# Altium project 大三_实训作业_智能家居控制.PrjPcb
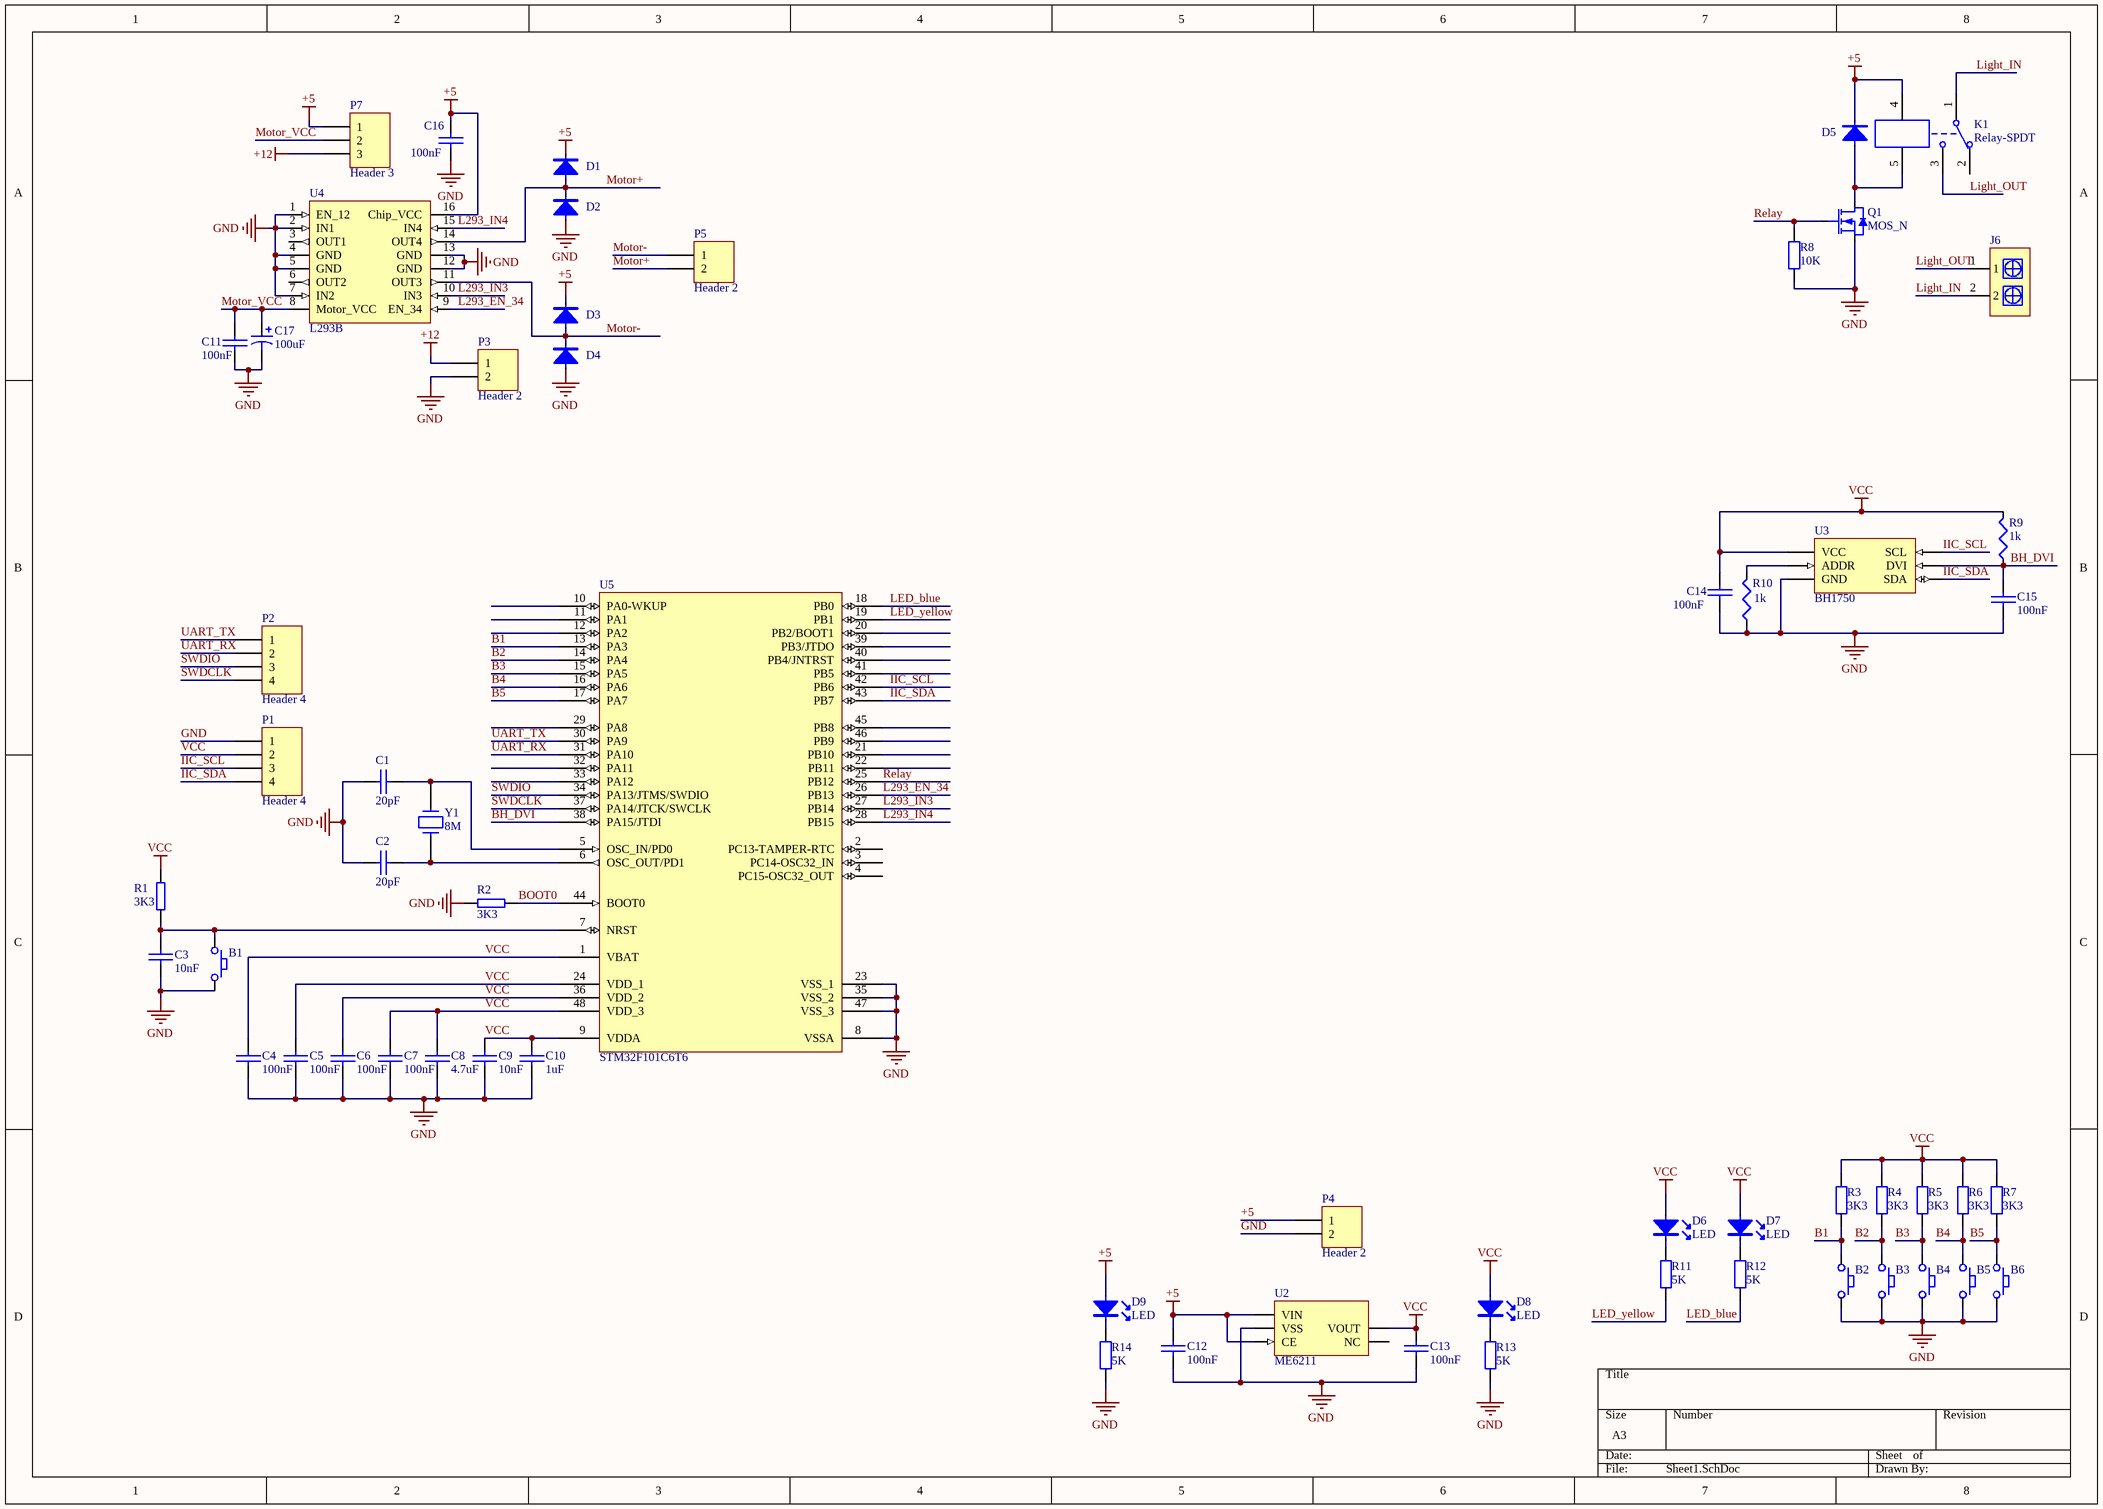
[diagram p0: Sheet1.SchDoc]
1 sheet, 60 parts. Net scope: global (net labels, ports and power ports of the same name join across sheets).
Board file: PCB1.PcbDoc

## Sheet Sheet1.SchDoc
size A3

### Parts
B1  button  [switch_2P]  (value not drawn)
B2  button  [switch_2P]  (value not drawn)
B3  button  [switch_2P]  (value not drawn)
B4  button  [switch_2P]  (value not drawn)
B5  button  [switch_2P]  (value not drawn)
B6  button  [switch_2P]  (value not drawn)
C1  20pF  [0603]
C2  20pF  [0603]
C3  10nF  [0603]
C4  100nF  [0603]
C5  100nF  [0603]
C6  100nF  [0603]
C7  100nF  [0603]
C8  4.7uF  [0603]
C9  10nF  [0603]
C10  1uF  [0603]
C11  100nF  [0603]
C12  100nF  [0603]
C13  100nF  [0603]
C14  100nF  [0603]
C15  100nF  [0603]
C16  100nF  [0603]
C17  100uF  [CAP_3.5_8mm]
D1  Diode_short  [SOD_123]  (value not drawn)
D2  Diode_short  [SOD_123]  (value not drawn)
D3  Diode_short  [SOD_123]  (value not drawn)
D4  Diode_short  [SOD_123]  (value not drawn)
D5  Diode_short  [SOD_123]  (value not drawn)
D6  LED  [0603-led]
D7  LED  [0603-led]
D8  LED  [0603-led]
D9  LED  [0603-led]
J6  7.62_螺丝固定端子  [7.62螺丝端子座]  (value not drawn)
K1  Relay-SPDT  [relay_5pin]
P1  Header 4  [HDR1X4]
P2  Header 4  [HDR1X4]
P3  Header 2  [HDR1X2]
P4  Header 2  [HDR1X2]
P5  Header 2  [2P_螺钉式接线端子_5.08mm]
P7  Header 3  [HDR1X3]
Q1  MOS_N  [SOT-23]
R1  3K3  [0603]
R2  3K3  [0603]
R3  3K3  [0603]
R4  3K3  [0603]
R5  3K3  [0603]
R6  3K3  [0603]
R7  3K3  [0603]
R8  10K  [0603]
R9  1k  [0603]
R10  1k  [0603]
R11  5K  [0603]
R12  5K  [0603]
R13  5K  [0603]
R14  5K  [0603]
U2  ME6211  [SOT-23-5]
U3  BH1750  [BH1750]
U4  L293B  [DIP16]
U5  STM32F101C6T6  [LQFP48_M]
Y1  8M  [5032]

### Nets
+5: C12.2 C16.2 D1.2 D3.2 D5.2 D9.1 K1.4 P4.1 P7.1 U2.1(VIN) U2.3(CE) U4.16(Chip_VCC)
+12: P3.1 P7.3
GND: B1.2 B2.2 B3.2 B4.2 B5.2 B6.2 C1.1 C2.1 C3.1 C4.1 C5.1 C6.1 C7.1 C8.1 C9.1 C10.1 C11.1 C12.1 C13.1 C14.1 C15.1 C16.1 C17.2 D2.1 D4.1 P1.1 P3.2 P4.2 Q1.2(S) R2.1 R8.2 R10.1 R13.2 R14.2 U2.2(VSS) U3.3(GND) U4.1(EN_12) U4.2(IN1) U4.4(GND) U4.5(GND) U4.7(IN2) U4.12(GND) U4.13(GND) U5.8(VSSA) U5.23(VSS_1) U5.35(VSS_2) U5.47(VSS_3)
VCC: C4.2 C5.2 C6.2 C7.2 C8.2 C9.2 C10.2 C13.2 C14.2 D6.1 D7.1 D8.1 P1.2 R1.2 R3.1 R4.1 R5.1 R6.1 R7.1 R9.2 U2.5(VOUT) U3.1(VCC) U5.1(VBAT) U5.9(VDDA) U5.24(VDD_1) U5.36(VDD_2) U5.48(VDD_3)
B1: B2.1 R3.2 U5.13(PA3)
B2: B3.1 R4.2 U5.14(PA4)
B3: B4.1 R5.2 U5.15(PA5)
B4: B5.1 R6.2 U5.16(PA6)
B5: B6.1 R7.2 U5.17(PA7)
BH_DVI: C15.2 R9.1 U3.5(DVI) U5.38(PA15/JTDI)
BOOT0: R2.2 U5.44(BOOT0)
IIC_SCL: P1.3 U3.6(SCL) U5.42(PB6)
IIC_SDA: P1.4 U3.4(SDA) U5.43(PB7)
L293_EN_34: U4.9(EN_34) U5.26(PB13)
L293_IN3: U4.10(IN3) U5.27(PB14)
L293_IN4: U4.15(IN4) U5.28(PB15)
LED_blue: R12.2 U5.18(PB0)
LED_yellow: R11.2 U5.19(PB1)
Light_IN: J6.2 K1.1
Light_OUT: J6.1 K1.3
Motor+: D1.1 D2.2 P5.2 U4.14(OUT4)
Motor-: D3.1 D4.2 P5.1 U4.11(OUT3)
Motor_VCC: C11.2 C17.1 P7.2 U4.8(Motor_VCC)
Relay: Q1.1(G) R8.1 U5.25(PB12)
SWDCLK: P2.4 U5.37(PA14/JTCK/SWCLK)
SWDIO: P2.3 U5.34(PA13/JTMS/SWDIO)
UART_RX: P2.2 U5.31(PA10)
UART_TX: P2.1 U5.30(PA9)
NetB1_1: B1.1 C3.2 R1.1 U5.7(NRST)
NetC1_2: C1.2 U5.5(OSC_IN/PD0) Y1.2
NetC2_2: C2.2 U5.6(OSC_OUT/PD1) Y1.1
NetD5_1: D5.1 K1.5 Q1.3(D)
NetD6_2: D6.2 R11.1
NetD7_2: D7.2 R12.1
NetD8_2: D8.2 R13.1
NetD9_2: D9.2 R14.1
NetR10_2: R10.2 U3.2(ADDR)

Not connected (* = marked no-connect by the designer): K1 2; U2 4(NC); U4 3(OUT1) 6(OUT2); U5 2(PC13-TAMPER-RTC) 3(PC14-OSC32_IN) 4(PC15-OSC32_OUT) 10(PA0-WKUP) 11(PA1) 12(PA2) 20(PB2/BOOT1) 21(PB10) 22(PB11) 29(PA8) 32(PA11) 33(PA12) 39(PB3/JTDO) 40(PB4/JNTRST) 41(PB5) 45(PB8) 46(PB9)

### Library data of the parts
C1-C16 = CAP: 电容
C17 = Cap Pol1: Polarized Capacitor (Radial); Published: 8-Jun-2000; LatestRevisionDate: 17-Jul-2002; LatestRevisionNote: Re-released for DXP Platform.; PackageReference: RB7.6-15; Publisher: Altium Limited; PackageDescription: Polarized Capacitor (Radial); 2 Leads; Value: 100uF
K1 = Relay-SPDT: Single-Pole Dual-Throw Relay; Published: 24-Mar-1999; LatestRevisionDate: 17-Jul-2002; LatestRevisionNote: Re-released for DXP Platform.; PackageReference: MODULE5B; Publisher: Altium Limited
P1 P2 = Header 4: Header, 4-Pin; LatestRevisionDate: 17-Jul-2002; LatestRevisionNote: Re-released for DXP Platform.; Publisher: Altium Limited
P3-P5 = Header 2: Header, 2-Pin; LatestRevisionDate: 17-Jul-2002; LatestRevisionNote: Re-released for DXP Platform.; Publisher: Altium Limited
P7 = Header 3: Header, 3-Pin; LatestRevisionDate: 17-Jul-2002; LatestRevisionNote: Re-released for DXP Platform.; Publisher: Altium Limited
R1 R2 = RES2
R3-R8 R11-R14 = Res2: Resistor; Value: 1K; Published: 8-Jun-2000; LatestRevisionDate: 17-Jul-2002; LatestRevisionNote: Re-released for DXP Platform.; PackageReference: AXIAL-0.4; Publisher: Altium Limited; PackageDescription: Axial Device, Thru-Hole; 2 Leads; 0.4 in Pin Spacing
R9 R10 = RES1
U4 = L293B: 4路电机驱动器
U5 = STM32F101C6T6: STM32 ARM-based 32-bit MCU with 32 Kbytes Flash, 48-pin LQFP, Industrial Temperature; Published: 30-May-2008; DatasheetVersion: rev6, Mar-2008; PackageVersion: Mar-2008; PackageReference: LQFP48; Publisher: Altium Limited; PackageDescription: 48-Pin Low-Profile Quad Flat Pack, 7 x 7 mm Body, 0.5 mm Pitch (LQFP48); ComponentLink1Description: Manufacturer Link; ComponentLink1URL: www.st.com/stm32; ComponentLink2Description: Datasheet; ComponentLink2URL: http://www.st.com/stonline/products/literature/ds/13586.pdf
Y1 = CRYSTAL: 晶体谐振器